# Altium schematic sheet STLink-V2-1.SchDoc
size A4; SheetNumber: 5; SheetTotal: 5
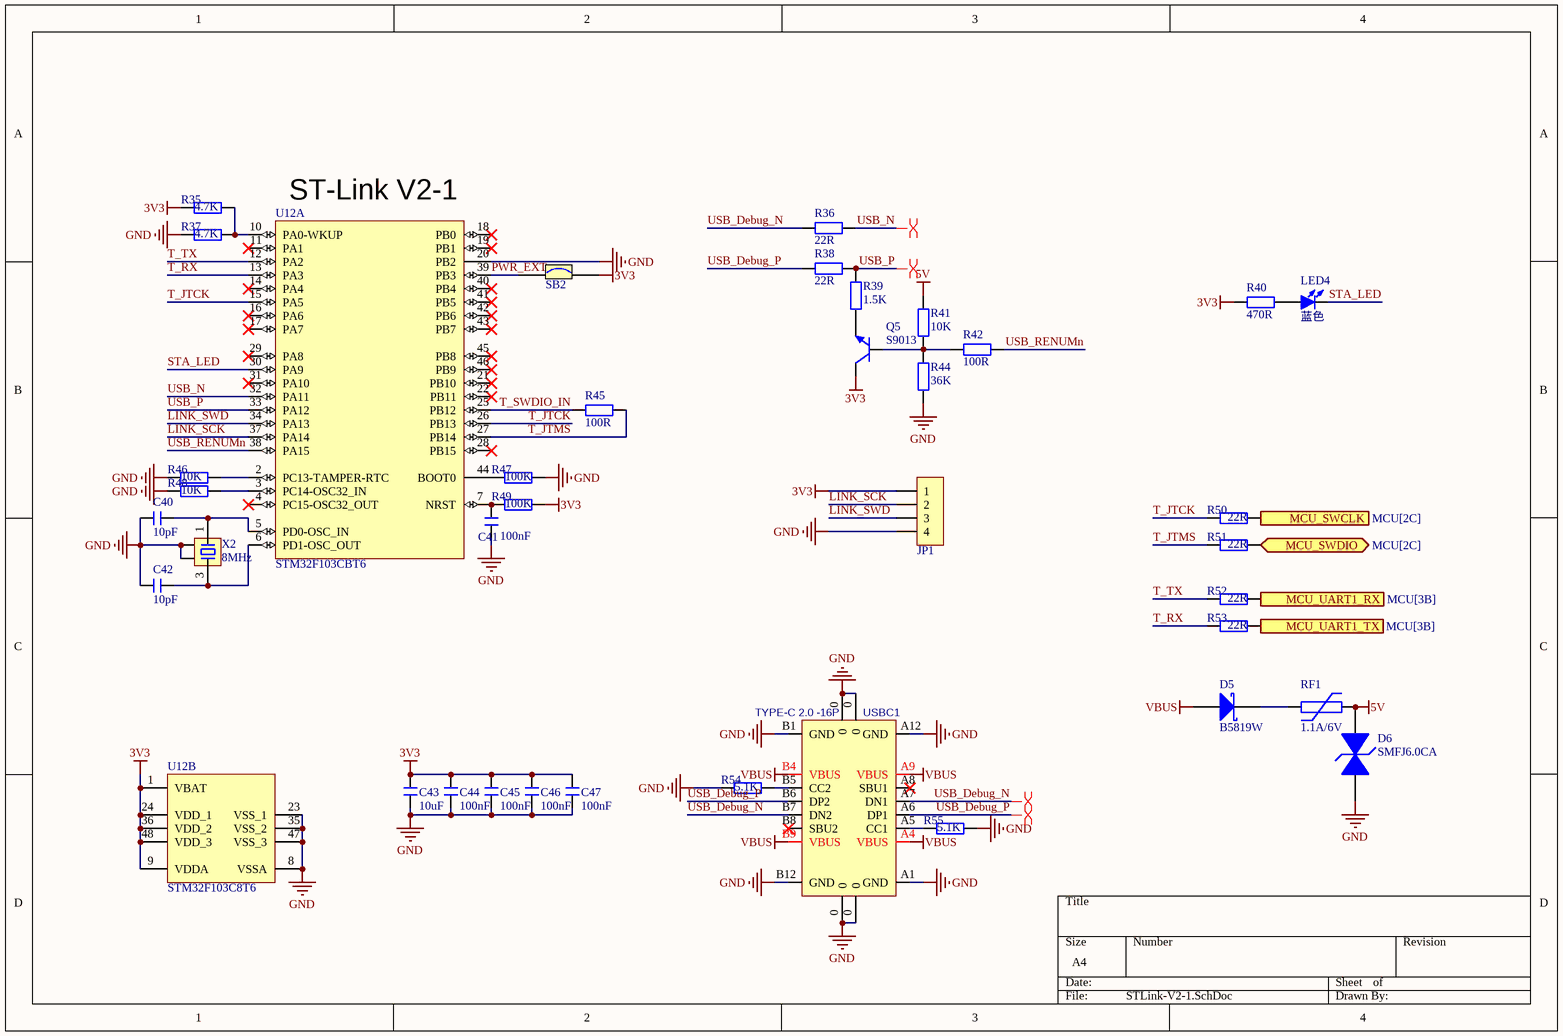
[diagram p0: STLink-V2-1.SchDoc]

## Parts
C40  10pF  [C 0402_L]
C41  100nF  [C 0402_L]
C42  10pF  [C 0402_L]
C43  10uF  [C 0402_L]
C44  100nF  [C 0402_L]
C45  100nF  [C 0402_L]
C46  100nF  [C 0402_L]
C47  100nF  [C 0402_L]
D5  B5819W  [MCC-SOD123_V]
D6  SMFJ6.0CA  [SMFJ6.0CA]
JP1  HDR-1X4  [HDR2.54-LI-4P]  (value not drawn)
LED4  蓝色  [LED 0603B]
Q5  S9013  [SOT23-3L]
R35  4.7K  [R 0402_L]
R36  22R  [R 0402_L]
R37  4.7K  [R 0402_L]
R38  22R  [R 0402_L]
R39  1.5K  [R 0402_L]
R40  470R  [R 0402_L]
R41  10K  [R 0402_L]
R42  100R  [R 0402_L]
R44  36K  [R 0402_L]
R45  100R  [R 0402_L]
R46  10K  [R 0402_L]
R47  100K  [R 0402_L]
R48  10K  [R 0402_L]
R49  100K  [R 0402_L]
R50  22R  [R 0402_L]
R51  22R  [R 0402_L]
R52  22R  [R 0402_L]
R53  22R  [R 0402_L]
R54  5.1K  [R 0402_L]
R55  5.1K  [R 0402_L]
RF1  1.1A/6V  [MF-NSMF110-2]
SB2  SelectBit  [SelectBit 0402]  (value not drawn)
U12  STM32F103CBT6  [STM-LQFP48_L]  (parts A,B of 2)
USBC1  TYPE-C 2.0 -16P  [USB-C-SMD_16P]
X2  8MHz  [XTAL-3225-4P]

## Ports
MCU_SWCLK (in, see MCU[2C]), MCU_SWDIO (bidir, see MCU[2C]), MCU_UART1_RX (out, see MCU[3B]), MCU_UART1_TX (in, see MCU[3B])

## Nets
3V3: C43.2 C44.2 C45.2 C46.2 C47.2 JP1.1 Q5.3(C) R35.1 R40.2 R49.1 SB2.2 U12.1(VBAT) U12.9(VDDA) U12.24(VDD_1) U12.36(VDD_2) U12.48(VDD_3)
5V: D6.2 R41.2 RF1.2
GND: C40.2 C41.1 C42.2 C43.1 C44.1 C45.1 C46.1 C47.1 D6.1 JP1.4 R37.1 R44.1 R46.2 R47.1 R48.2 R54.2 R55.1 U12.8(VSSA) U12.20(PB2) U12.23(VSS_1) U12.35(VSS_2) U12.47(VSS_3) USBC1.0 USBC1.A1(GND) USBC1.A12(GND) USBC1.B1(GND) USBC1.B12(GND) X2.2 X2.4
VBUS: D5.1(A) USBC1.A4(VBUS) USBC1.A9(VBUS) USBC1.B4(VBUS) USBC1.B9(VBUS)
LINK_SCK: JP1.2 U12.37(PA14)
LINK_SWD: JP1.3 U12.34(PA13)
MCU_SWCLK: R50.1 ; port MCU_SWCLK
MCU_SWDIO: R51.1 ; port MCU_SWDIO
MCU_UART1_RX: R52.1 ; port MCU_UART1_RX
MCU_UART1_TX: R53.1 ; port MCU_UART1_TX
PWR_EXT: SB2.1 U12.39(PB3)
STA_LED: LED4.2(K) U12.30(PA9)
T_JTCK: R50.2 U12.15(PA5) U12.26(PB13)
T_JTMS: R45.1 R51.2 U12.27(PB14)
T_RX: R53.2 U12.13(PA3)
T_SWDIO_IN: R45.2 U12.25(PB12)
T_TX: R52.2 U12.12(PA2)
USB_Debug_N: R36.1 USBC1.A7(DN1) USBC1.B7(DN2)
USB_Debug_P: R38.1 USBC1.A6(DP1) USBC1.B6(DP2)
USB_N: R36.2 U12.32(PA11)
USB_P: R38.2 R39.2 U12.33(PA12)
USB_RENUMn: R42.1 U12.38(PA15)
NetC40_1: C40.1 U12.5(PD0-OSC_IN) X2.1
NetC41_2: C41.2 R49.2 U12.7(NRST)
NetC42_1: C42.1 U12.6(PD1-OSC_OUT) X2.3
NetD5_2: D5.2(K) RF1.1
NetLED4_1: LED4.1(A) R40.1
NetQ5_1: Q5.1(B) R41.1 R42.2 R44.2
NetQ5_2: Q5.2(E) R39.1
NetR35_2: R35.2 R37.2 U12.10(PA0-WKUP)
NetR46_1: R46.1 U12.2(PC13-TAMPER-RTC)
NetR47_2: R47.2 U12.44(BOOT0)
NetR48_1: R48.1 U12.3(PC14-OSC32_IN)
NetR54_1: R54.1 USBC1.B5(CC2)
NetR55_2: R55.2 USBC1.A5(CC1)

Not connected (* = marked no-connect by the designer): U12 4(PC15-OSC32_OUT)* 11(PA1)* 14(PA4)* 16(PA6)* 17(PA7)* 18(PB0)* 19(PB1)* 21(PB10)* 22(PB11)* 28(PB15)* 29(PA8)* 31(PA10)* 40(PB4)* 41(PB5)* 42(PB6)* 43(PB7)* 45(PB8)* 46(PB9)*; USBC1 A8(SBU1)* B8(SBU2)*

## Layout directives
differential pair: USB_Debug_N, USB_Debug_P, USB_N, USB_P

## Notes on the sheet
- (near U12) ST-Link V2-1

## Library data of the parts
C40-C47 = C: 无极性贴片电容; 版权归属: 源创客; BOM名称: 无极性贴片电容; 学习资源: www.ooocke.com
D5 = CMP-2100-03587-1: Schottky Barrier Rectifier, 1 A, 40 Vrm, -65 to 125 degC, 2-Pin SOD123, RoHS, Tape and Reel; Manufacturer: Micro Commercial Components; Package Description: 2-Pin Small Outline Diode, Body 2.7 x 1.6 mm, Height 1.35 mm; Datasheet URL: http://www.mccsemi.com/up_pdf/B5817W-B5819W(SOD-123).pdf; Manufacturer URL: http://www.mccsemi.com/; Package Reference: SOD123; Package URL: http://www.mccsemi.com/up_pdf/1N4448W(SOD-123).pdf; Datasheet Version: Rev. B, 01/2013
D6 = SMFJ6.0CA: 贴片TVS瞬变抑制二极管
JP1 = Header 4: 4P接插件; 封装库来自淘宝卖家 ID：黄晶宝石: 其他店铺购入均为盗版假冒封装库; 联系卖家，免费查找封装: 唯一出售店铺网址https://shop463601444.taobao.com; BOM名称: 4P接插件
LED4 = LED-SMD: 贴片LED; 版权归属: 源创客; BOM名称: 贴片LED; 学习资源: www.ooocke.com
Q5 = 9013-SMD: 低频放大-NPN型; 版权归属: 源创客; 属性: 50V?0.5A?0.625W; BOM名称: 低频放大-NPN型; 学习资源: www.ooocke.com
R35-R42 R44-R55 = R: 贴片电阻; 版权归属: 源创客; BOM名称: 贴片电阻; 学习资源: www.ooocke.com
RF1 = PPTC: PPTC自恢复保险丝; 版权归属: 源创客; BOM名称: PPTC自恢复保险丝; 学习资源: www.ooocke.com
SB2 = SelectBit: 跨接桥，用于选择不同的模式，可以用锡连上，或者焊上0R电阻
U12 = CMP-0237-00215-3: ARM Cortex-M3 32-bit MCU, 64 KB Flash, 20 KB Internal RAM, 37 I/Os, 48-pin LQFP, -40 to 85 degC, Tray; PartNumber: STM32F103C8T6; Supply Voltage(Vcc) min (V): 2; Internal RAM Size (kB): 20; FLASH Size (Prog) (kB): 64; A/D Converter: 2x12-bit (10 Channel); I/Os (High Current): 37; Operating Frequency(F) (Processor speed) (MHz): 72; Core: ARM Cortex-M3; ComponentLink3Description: Package Specification; Mounting Technology: Surface Mount; PackageReference: LQFP48; Packing: Tray; ComponentLink3URL: http://www.st.com/st-web-ui/static/active/en/resource/technical/document/datasheet/DM00058181.pdf; DatasheetVersion: Rev. 16; ComponentLink1URL: http://www.st.com/web/en/home.html; PackageVersion: Rev. 6, 06/2013; ComponentLink2URL: http://www.st.com/st-web-ui/static/active/en/resource/technical/document/datasheet/CD00161566.pdf; ComponentLink1Description: Manufacturer URL; ComponentLink2Description: Datasheet; PackageDescription: 48-Pin Low Profile Quad Flat Package, 7 x 7 mm Body, 0.5 mm Pitch
USBC1 = USB2.0_Type-C_16Pin: USB2.0_Type-C_16Pin母座; 联系卖家 免费查找封装: 唯一出售店铺网址https://shop463601444.taobao.com; 联系卖家 免费技术支持: 封装库来自淘宝卖家ID：黄晶宝石
X2 = XTAL-4P: 4脚无源晶振(谐振器）; 联系卖家，免费查找封装: 唯一出售店铺网址https://shop463601444.taobao.com; BOM名称: 4脚无源晶振(谐振器）